# EAGLE design slipring (EAGLE 9.5.0)
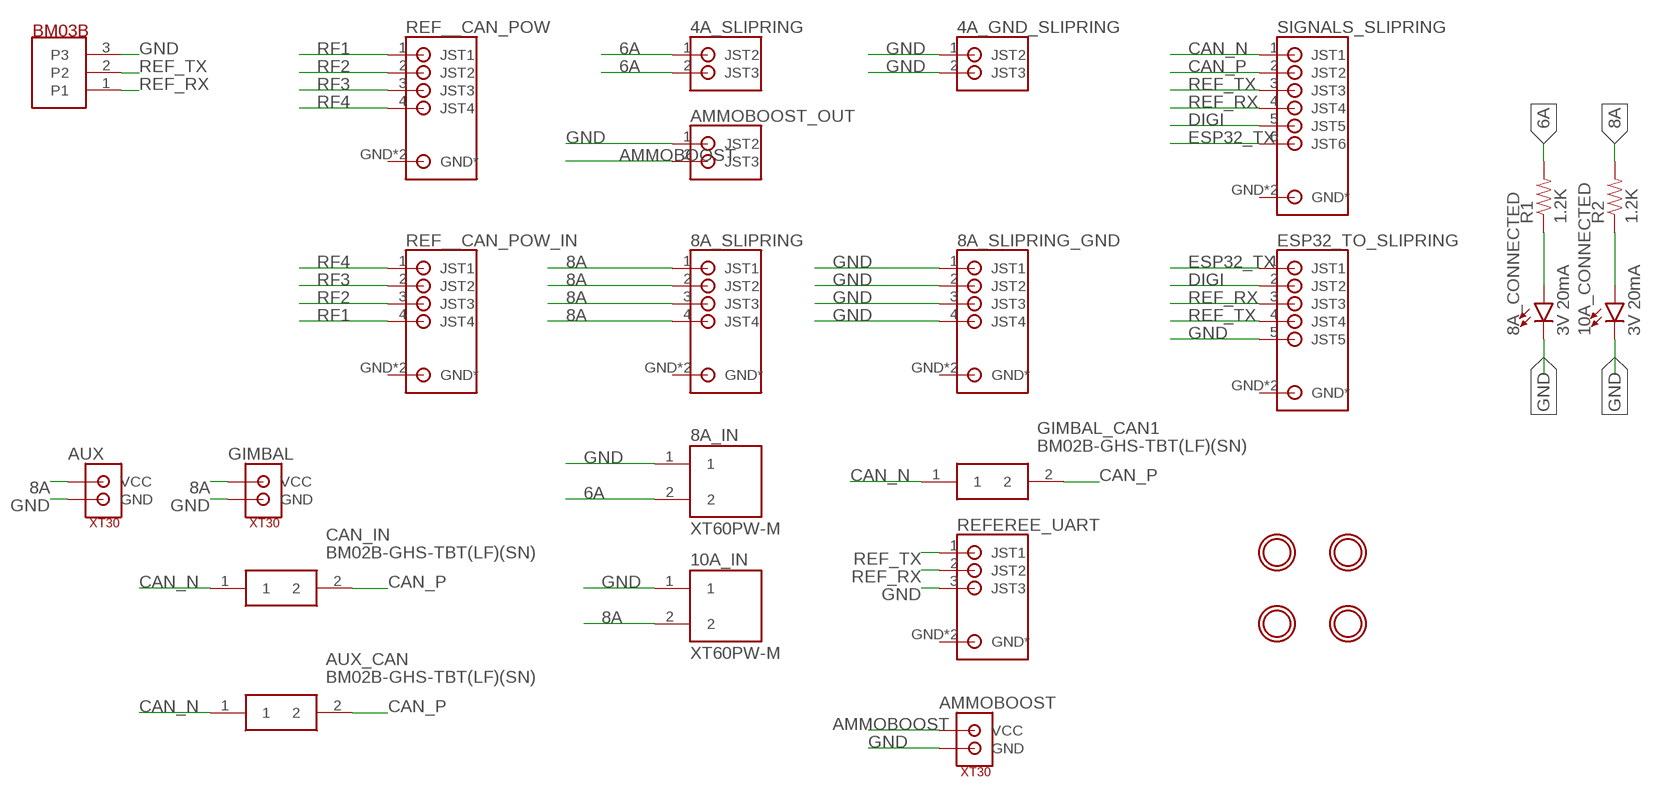
[diagram p0: schematic, sheet 1]

## Parts
4A_GND_SLIPRING  S2B-PH-SM4_TB  [S2B-PH-SM4_TB]
4A_SLIPRING  S2B-PH-SM4_TB  [S2B-PH-SM4_TB]
8A_CONNECTED  3V 20mA  LED1206  [LED-1206]
8A_IN  XT60PW-M  [AMASS_XT60PW-M]
8A_SLIPRING  S4B-PH-SM4_TB  [S4B-PH-SM4_TB]
8A_SLIPRING_GND  S4B-PH-SM4_TB  [S4B-PH-SM4_TB]
10A_CONNECTED  3V 20mA  LED1206  [LED-1206]
10A_IN  XT60PW-M  [AMASS_XT60PW-M]
AMMOBOOST  XT30  [XT30]
AMMOBOOST_OUT  S2B-PH-SM4_TB  [S2B-PH-SM4_TB]
AUX  XT30  [XT30]
AUX_CAN  BM02B-GHS-TBT(LF)(SN)  [BM02B-GHS-TBT_1]
CAN_IN  BM02B-GHS-TBT(LF)(SN)  [BM02B-GHS-TBT_1]
ESP32_TO_SLIPRING  S5B-PH-SM4_TB  [S5B-PH-SM4_TB]
GIMBAL  XT30  [XT30]
GIMBAL_CAN1  BM02B-GHS-TBT(LF)(SN)  [BM02B-GHS-TBT_1]
R1  1.2K  RESISTOR2010  [R2010]
R2  1.2K  RESISTOR2010  [R2010]
REF__CAN_POW  S4B-PH-SM4_TB  [S4B-PH-SM4_TB]
REF__CAN_POW_IN  S4B-PH-SM4_TB  [S4B-PH-SM4_TB]
REF_UART  BM03-GHS_TBT  [BM03-GHS-TBT]
REFEREE_UART  S3B-PH-SM4_TB  [S3B-PH-SM4_TB]
SIGNALS_SLIPRING  S6B-PH-SM4_TB  [S6B-PH-SM4_TB]
U$1  MOUNTINGHOLE2.5  [MOUNTINGHOLE_2.5_PLATED]
U$2  MOUNTINGHOLE2.5  [MOUNTINGHOLE_2.5_PLATED]
U$4  MOUNTINGHOLE2.5  [MOUNTINGHOLE_2.5_PLATED]
U$49  MOUNTINGHOLE2.5  [MOUNTINGHOLE_2.5_PLATED]

## Nets
6A: 4A_SLIPRING.1(JST2) 4A_SLIPRING.2(JST3) 8A_IN.2 R1.2
8A: 8A_SLIPRING.1(JST1) 8A_SLIPRING.2(JST2) 8A_SLIPRING.3(JST3) 8A_SLIPRING.4(JST4) 10A_IN.2 AUX.P$2(VCC) GIMBAL.P$2(VCC) R2.2
AMMOBOOST: AMMOBOOST.P$2(VCC) AMMOBOOST_OUT.2(JST3)
CAN_N: AUX_CAN.1 CAN_IN.1 GIMBAL_CAN1.1 SIGNALS_SLIPRING.1(JST1)
CAN_P: AUX_CAN.2 CAN_IN.2 GIMBAL_CAN1.2 SIGNALS_SLIPRING.2(JST2)
DIGI: ESP32_TO_SLIPRING.2(JST2) SIGNALS_SLIPRING.5(JST5)
ESP32_TX: ESP32_TO_SLIPRING.1(JST1) SIGNALS_SLIPRING.6(JST6)
GND: 4A_GND_SLIPRING.1(JST2) 4A_GND_SLIPRING.2(JST3) 8A_CONNECTED.C 8A_IN.1 8A_SLIPRING_GND.1(JST1) 8A_SLIPRING_GND.2(JST2) 8A_SLIPRING_GND.3(JST3) 8A_SLIPRING_GND.4(JST4) 10A_CONNECTED.C 10A_IN.1 AMMOBOOST.P$1(GND) AMMOBOOST_OUT.1(JST2) AUX.P$1(GND) ESP32_TO_SLIPRING.5(JST5) GIMBAL.P$1(GND) REF_UART.3 REFEREE_UART.3(JST3)
N$1 [sig]: 10A_CONNECTED.A R2.1
N$2 [sig]: 8A_CONNECTED.A R1.1
REF_RX: ESP32_TO_SLIPRING.3(JST3) REF_UART.1 REFEREE_UART.2(JST2) SIGNALS_SLIPRING.4(JST4)
REF_TX: ESP32_TO_SLIPRING.4(JST4) REF_UART.2 REFEREE_UART.1(JST1) SIGNALS_SLIPRING.3(JST3)
RF1: REF__CAN_POW.1(JST1) REF__CAN_POW_IN.4(JST4)
RF2: REF__CAN_POW.2(JST2) REF__CAN_POW_IN.3(JST3)
RF3: REF__CAN_POW.3(JST3) REF__CAN_POW_IN.2(JST2)
RF4: REF__CAN_POW.4(JST4) REF__CAN_POW_IN.1(JST1)
Unconnected: 8A_SLIPRING.GND2(GND*) 8A_SLIPRING.GND(GND*) 8A_SLIPRING_GND.GND2(GND*) 8A_SLIPRING_GND.GND(GND*) ESP32_TO_SLIPRING.GND2(GND*) ESP32_TO_SLIPRING.GND(GND*) REF__CAN_POW.GND2(GND*) REF__CAN_POW.GND(GND*) REF__CAN_POW_IN.GND2(GND*) REF__CAN_POW_IN.GND(GND*) REFEREE_UART.GND2(GND*) REFEREE_UART.GND(GND*) SIGNALS_SLIPRING.GND2(GND*) SIGNALS_SLIPRING.GND(GND*)

## Library data of the parts
4A_GND_SLIPRING 4A_SLIPRING AMMOBOOST_OUT = NewKevinMade:S2B-PH-SM4_TB
8A_CONNECTED 10A_CONNECTED = SparkFun-LED:LED: LED (Generic) Standard schematic elements and footprints for 5mm, 3mm, 1206, and 0603 sized LEDs. Generic LEDs with no color specified.
8A_IN 10A_IN = XT60PW-M:XT60PW-M; AVAILABILITY: Unavailable; MF: AMASS; MP: XT60PW-M; PACKAGE: Package Analog Devices; PRICE: None
8A_SLIPRING 8A_SLIPRING_GND REF__CAN_POW REF__CAN_POW_IN = NewKevinMade:S4B-PH-SM4_TB
AMMOBOOST AUX GIMBAL = NewKevinMade:XT30
AUX_CAN CAN_IN GIMBAL_CAN1 = SamacSys_Parts:BM02B-GHS-TBT(LF)(SN): GH 1.25mm header top entry 2 way JST GH Series, 1.25mm Pitch 2 Way Shrouded Straight PCB Header, Surface Mount, Solder Termination Source: Datasheet <http://uk.rs-online.com/web/p/products/7521762P>; DESCRIPTION: GH 1.25mm header top entry 2 way JST GH Series, 1.25mm Pitch 2 Way Shrouded Straight PCB Header, Surface Mount, Solder Termination; HEIGHT: mm; MANUFACTURER_NAME: JST (JAPAN SOLDERLESS TERMINALS); MANUFACTURER_PART_NUMBER: BM02B-GHS-TBT(LF)(SN); RS_PART_NUMBER: 7521762P
ESP32_TO_SLIPRING = NewKevinMade:S5B-PH-SM4_TB
R1 R2 = SparkFun-Passives:RESISTOR: Resistor Basic schematic elements and footprints for 0603, 1206, and PTH resistors.
REF_UART = SamacSys_Parts:BM03-GHS_TBT
REFEREE_UART = NewKevinMade:S3B-PH-SM4_TB
SIGNALS_SLIPRING = NewKevinMade:S6B-PH-SM4_TB
U$1 U$2 U$4 U$49 = microbuilder:MOUNTINGHOLE: Mounting Hole For #2 screws (0.086"/2.18mm width, 0.094"/2.4mm hole) use 2.5mm; BOM: EXCLUDE

## Net classes
1 sig: width 0.254 mm, drill 0.305 mm, clearance 0.127 mm

## Board
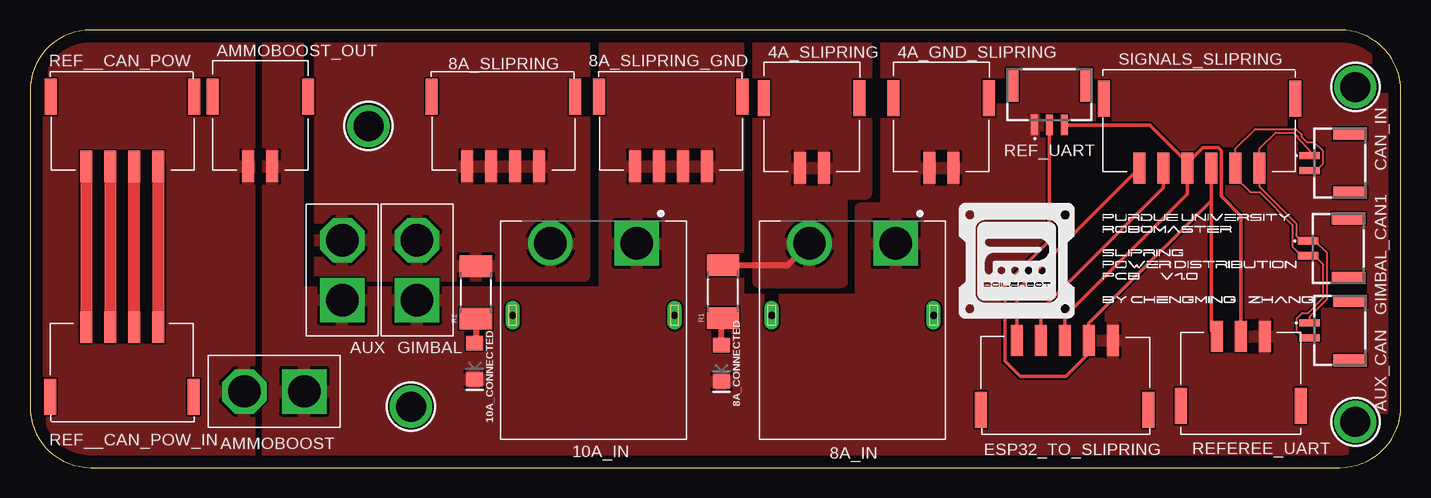
[diagram p1: board, top side]

Size 114.28 x 36.5 mm. Coordinates in mm from the lower left corner, seen from the top.
Outline: 109.2,36.5 5.08,36.5 arc90 0,31.42 0,5.08 arc90 5.08,0 109.2,0 arc90 114.28,5.08 114.28,31.42 arc90 109.2,36.5
Copper layers (1*16): Top 0.035mm / dielectric 1.5mm / Bottom 0.035mm
Design rules "default": minimum track width 6mil, minimum drill 0.35mm, track to track 6mil, track to pad 6mil, pad to pad 6mil, via to via 6mil, smd to smd 6mil, copper to edge 40mil, drill to drill 6mil, minimum pad ring 10mil, minimum via ring 8mil, stop-mask expansion 4mil, vias tented up to drill 0mil, thermal gap 10mil

### Footprints (pad centres in the part's own frame; a part is rotated, then mirrored left to right if it is on the bottom)
S2B-PH-SM4_TB = smd 1 x 2.6: 1 3.81,8.28; 2 5.81,8.28 | smd 1 x 3: GND 0.826,2.48; GND2 8.787,2.48
LED-1206 = smd 1.2 x 1.4: A -1.5,0; C 1.5,0
AMASS_XT60PW-M = drill 2.7 square: 1 -3.6,-6 | drill 2.7: 2 3.6,-6 | drill 0.6 pad 1.2 long: S1 -6.75,0; S2 6.75,0
S4B-PH-SM4_TB = smd 1 x 2.6: 1 3.27,7.9; 2 5.27,7.9; 3 7.27,7.9; 4 9.27,7.9 | smd 1 x 3: GND 0.286,2.1; GND2 12.254,2.1
XT30 = drill 2.7 square: P$1 0,0 | drill 2.7 octagon: P$2 5,0
BM02B-GHS-TBT_1 = smd 0.6 x 1.7: 1 0.625,0; 2 -0.625,0 | smd 1 x 2.8: 3 -2.475,-3.35; 4 2.475,-3.35
S5B-PH-SM4_TB = smd 1 x 2.6: 1 4.92,9.33; 2 6.92,9.33; 3 8.92,9.33; 4 10.92,9.33; 5 12.92,9.33 | smd 1 x 3: GND 1.936,3.53; GND2 15.904,3.53
R2010 = smd 1.8 x 2.7: 1 -2.2,0; 2 2.2,0
BM03-GHS-TBT = smd 0.6 x 1.7: 1 1.915,5.08; 2 3.165,5.08; 3 4.415,5.08 | smd 1 x 2.8: A 0.065,1.73; B 6.245,1.73
S3B-PH-SM4_TB = smd 1 x 2.6: 1 3.81,8.28; 2 5.81,8.28; 3 7.81,8.28 | smd 1 x 3: GND 0.826,2.48; GND2 10.794,2.48
S6B-PH-SM4_TB = smd 1 x 2.6: 1 5.46,9.68; 2 7.46,9.68; 3 9.46,9.68; 4 11.46,9.68; 5 13.46,9.68; 6 15.46,9.68 | smd 1 x 3: GND 2.476,3.88; GND2 18.444,3.88
MOUNTINGHOLE_2.5_PLATED = drill 2.5 pad 3.2: P$1 0,0

### Placement (x,y rotation side)
4A_GND_SLIPRING  80.77,33.27 180 top
4A_SLIPRING  69.98,33.27 180 top
8A_CONNECTED  57.65,8.69 270 top
8A_IN  68.58,12.7 180 top
8A_SLIPRING  45.72,33.02 180 top
8A_SLIPRING_GND  59.69,33.02 180 top
10A_CONNECTED  37.07,8.87 270 top
10A_IN  46.99,12.7 180 top
AMMOBOOST  22.86,6.35 180 top
AMMOBOOST_OUT  24,33.4 180 top
AUX  26.04,13.97 90 top
AUX_CAN  106.68,11.43 90 top
CAN_IN  106.68,25.4 90 top
ESP32_TO_SLIPRING  77.34,1.27 0 top
GIMBAL  32.26,13.97 90 top
GIMBAL_CAN1  106.55,18.29 90 top
R1  57.77,14.67 90 top
R2  37.18,14.61 90 top
REF__CAN_POW  13.97,33.02 180 top
REF__CAN_POW_IN  1.4,3.81 0 top
REF_UART  88.14,33.66 180 top
REFEREE_UART  95.12,2.67 0 top
SIGNALS_SLIPRING  107.95,34.67 180 top
U$1  31.75,5.08 0 top
U$2  110.49,3.81 0 top
U$4  28.21,28.49 0 top
U$49  110.49,31.75 0 top

### Tracks (layer width: path | path; a pad name or v marks a point on that pad's centre or on a via)
6A
  Top 0.508: R1.2 63.15,16.87 8A_IN.2
  pour Top: 60.71,35.56 60.71,15.49 67.69,15.49 67.69,22.86 69.72,22.86 69.72,35.56
8A
  pour Top: 24.13,36.83 24.13,16 46.23,16 46.23,36.83
AMMOBOOST
  pour Top: 18.29,38.1 18.29,-1.27 -1.14,-1.27 -1.14,38.1
CAN_N
  Top 0.152: CAN_IN.1 106.68,26.46 105.67,27.46 105.67,27.59 105.41,27.85 105.41,27.94 103.83,27.94 102.49,26.6 SIGNALS_SLIPRING.1 102.49,23.42 105.55,20.36 105.55,19.36 106,18.91 GIMBAL_CAN1.1 107.1,18.91 108.14,17.88 108.14,14.05 106.68,12.59 AUX_CAN.1
CAN_P
  Top 0.152: CAN_IN.2 107.23,24.77 107.76,25.3 107.76,26.42 107.03,27.15 106.42,27.15 105.98,27.59 105.98,27.8 105.54,28.25 102.14,28.25 100.49,26.6 SIGNALS_SLIPRING.2 100.49,24.19 101.71,22.97 102.51,22.97 105.25,20.23 105.25,18.42 106,17.66 GIMBAL_CAN1.2 107.1,17.66 107.83,16.93 107.83,14.18 106.56,12.9 106.05,12.9 105.6,12.45 105.6,11.33 106.13,10.8 AUX_CAN.2
DIGI
  Top 0.305: ESP32_TO_SLIPRING.2 84.26,13.14 94.49,23.37 SIGNALS_SLIPRING.5
ESP32_TX
  Top 0.305: SIGNALS_SLIPRING.6 82.26,14.76 ESP32_TO_SLIPRING.1
GND
  pour Top: 19.81,35.56 19.81,0 114.3,0 114.3,38.1 71.37,38.1 71.37,21.59 69.22,21.59 69.22,13.97 59.05,13.97 59.05,38.1 47.88,38.1 47.88,14.61 22.35,14.61 22.35,35.56
N$1
  Top 0.508: R2.1 37.18,10.48 10A_CONNECTED.A
N$2
  Top 0.508: 8A_CONNECTED.A 57.65,12.34 R1.1
REF_RX
  Top 0.305: ESP32_TO_SLIPRING.3 86.26,12.6 96.49,22.83 SIGNALS_SLIPRING.4 | REFEREE_UART.2 100.93,20.99 99.3,22.62 99.3,26.42 99.04,26.67 97.79,26.67 96.49,25.37 SIGNALS_SLIPRING.4 | SIGNALS_SLIPRING.4 96.49,25.43 93.34,28.57 REF_UART.1
REF_TX
  Top 0.305: REFEREE_UART.1 98.49,11.39 SIGNALS_SLIPRING.3 98.49,22.29 88.26,12.06 ESP32_TO_SLIPRING.4 88.26,9.52 86.36,7.62 82.55,7.62 81.28,8.89 81.28,15.24 84.97,18.93 REF_UART.2
RF1
  Top 1.016: REF__CAN_POW.1 10.7,11.74 REF__CAN_POW_IN.4
RF2
  Top 0.305: 8.7,11.74 REF__CAN_POW_IN.3
  Top 1.016: REF__CAN_POW_IN.3 8.67,25.09 REF__CAN_POW.2
RF3
  Top 1.016: REF__CAN_POW.3 6.7,11.74 REF__CAN_POW_IN.2
RF4
  Top 1.016: REF__CAN_POW.4 4.7,11.74 REF__CAN_POW_IN.1

### Text on the board
tPlace: /Users/ChengMing/Desktop/The offical logo.bmp | /Users/ChengMing/Desktop/The offical logo.bmp